# EAGLE design NSL_Cylon (EAGLE 5.10)
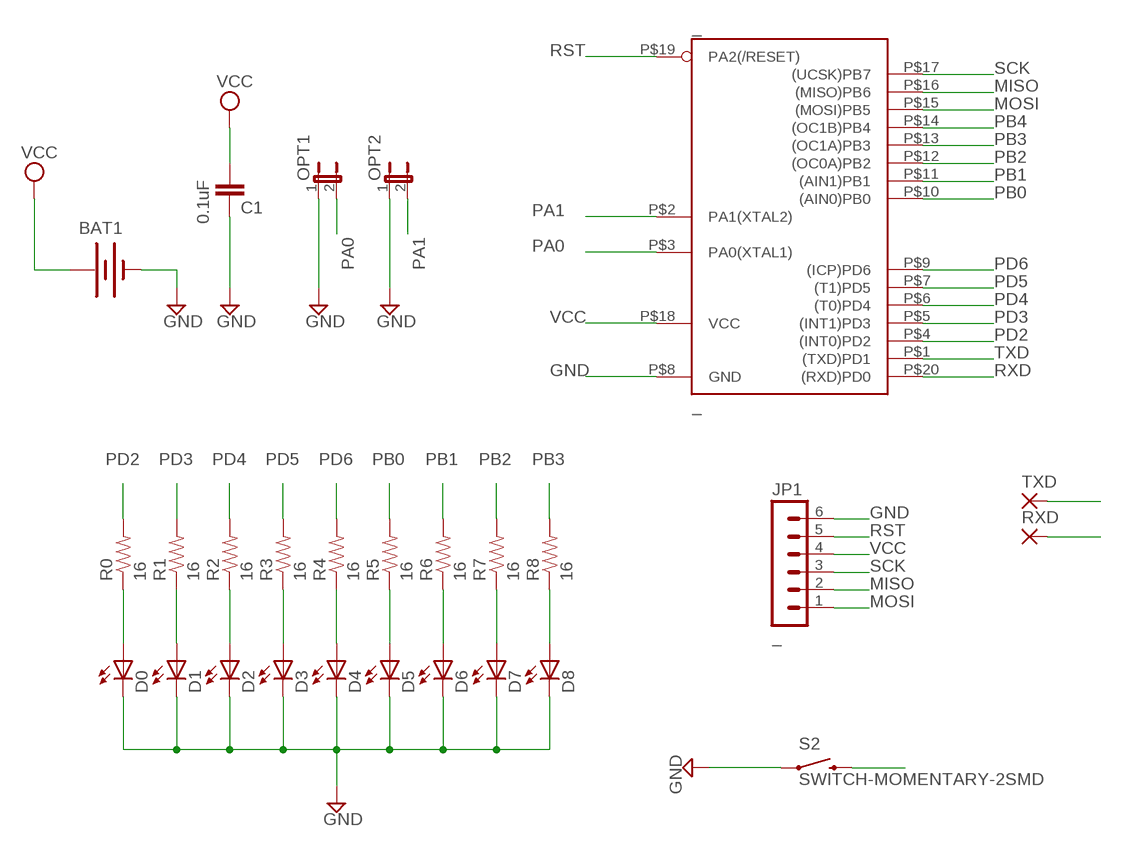
[diagram p0: schematic, sheet 1]

## Parts
_  _  TINY2313-*M*  [MLF20]
BAT1  SPARKFUN_BATTERYSPARKFUN_BATTCOMM_20MM_LINX  [SPARKFUN_BATTCOM_20MM_LINX]
C1  0.1uF  CAP0805  [0805]
D0  SPARKFUN_LED1206  [SPARKFUN_LED-1206]
D1  SPARKFUN_LED1206  [SPARKFUN_LED-1206]
D2  SPARKFUN_LED1206  [SPARKFUN_LED-1206]
D3  SPARKFUN_LED1206  [SPARKFUN_LED-1206]
D4  SPARKFUN_LED1206  [SPARKFUN_LED-1206]
D5  SPARKFUN_LED1206  [SPARKFUN_LED-1206]
D6  SPARKFUN_LED1206  [SPARKFUN_LED-1206]
D7  SPARKFUN_LED1206  [SPARKFUN_LED-1206]
D8  SPARKFUN_LED1206  [SPARKFUN_LED-1206]
JP1  _  MA06-1  [MA06-1]
OPT1  JUMPER-2PTH  [1X02]
OPT2  JUMPER-2PTH  [1X02]
R0  16  RESISTOR0603-RES  [0603-RES]
R1  16  RESISTOR0603-RES  [0603-RES]
R2  16  RESISTOR0603-RES  [0603-RES]
R3  16  RESISTOR0603-RES  [0603-RES]
R4  16  RESISTOR0603-RES  [0603-RES]
R5  16  RESISTOR0603-RES  [0603-RES]
R6  16  RESISTOR0603-RES  [0603-RES]
R7  16  RESISTOR0603-RES  [0603-RES]
R8  16  RESISTOR0603-RES  [0603-RES]
RXD  SMD2  [SMD1,27-2,54]
S2  SWITCH-MOMENTARY-2SMD  [TACTILE_SWITCH_SMD]
TXD  SMD2  [SMD1,27-2,54]

## Nets
GND [power]: _.P$8(GND) BAT1.2(-) C1.2 D0.C D1.C D2.C D3.C D4.C D5.C D6.C D7.C D8.C JP1.6 OPT1.1 OPT2.1 S2.1
MISO: _.P$16((MISO)PB6) JP1.2
MOSI: _.P$15((MOSI)PB5) JP1.1
N$8 [leds]: D0.A R0.1
N$9 [leds]: D1.A R1.1
N$10 [leds]: D2.A R2.1
N$11 [leds]: D3.A R3.1
N$12 [leds]: D4.A R4.1
N$13 [leds]: D5.A R5.1
N$14 [leds]: D6.A R6.1
N$15 [leds]: D7.A R7.1
N$16 [leds]: D8.A R8.1
PA0: _.P$3(PA0(XTAL1)) OPT1.2
PA1: _.P$2(PA1(XTAL2)) OPT2.2
PB0: _.P$10((AIN0)PB0) R5.2
PB1: _.P$11((AIN1)PB1) R6.2
PB2: _.P$12((OC0A)PB2) R7.2
PB3: _.P$13((OC1A)PB3) R8.2
PB4: _.P$14((OC1B)PB4) S2.3
PD2: _.P$4((INT0)PD2) R0.2
PD3: _.P$5((INT1)PD3) R1.2
PD4: _.P$6((T0)PD4) R2.2
PD5: _.P$7((T1)PD5) R3.2
PD6: _.P$9((ICP)PD6) R4.2
RST: _.P$19(PA2(/RESET)) JP1.5
RXD: _.P$20((RXD)PD0) RXD.1(P)
SCK: _.P$17((UCSK)PB7) JP1.3
TXD: _.P$1((TXD)PD1) TXD.1(P)
VCC [power]: _.P$18(VCC) BAT1.1(+) C1.1 JP1.4

## Library data of the parts
_ = NSL_Cylon:TINY2313*: Atmel Tiny2313 2K Flash, 128 bytes EEPROM, 128 bytes RAM
BAT1 = NSL:SPARKFUN_BATTERY: Battery Holders Various common sizes : AA, AAA, 20mm coin cell and 12mm coin cell.
C1 = SparkFun:CAP: Capacitor Standard 0603 ceramic capacitor, and 0.1" leaded capacitor.
D0 D1-D8 = NSL:SPARKFUN_LED: LEDs Standard schematic elements and footprints for 5mm, 3mm, 1206, and 0603 sized LEDs. 5mm - Spark Fun Electronics SKU : COM-00529 (and others)
JP1 = con-lstb:MA06-1: PIN HEADER
OPT1 OPT2 = SparkFun:JUMPER-2: Jumper Basic 0.1" spaced jumper. Use with breakaway headers.
R0 R1-R8 = SparkFun:RESISTOR: Resistor Basic schematic elements and footprints for 0603, 1206, and PTH 1/10th watt (small) resistors.
RXD TXD = wirepad:SMD2: SMD PAD
S2 = SparkFun:SWITCH-MOMENTARY-2

## Net classes
1 power: width 0.254 mm
2 leds: width 0.508 mm

## Board
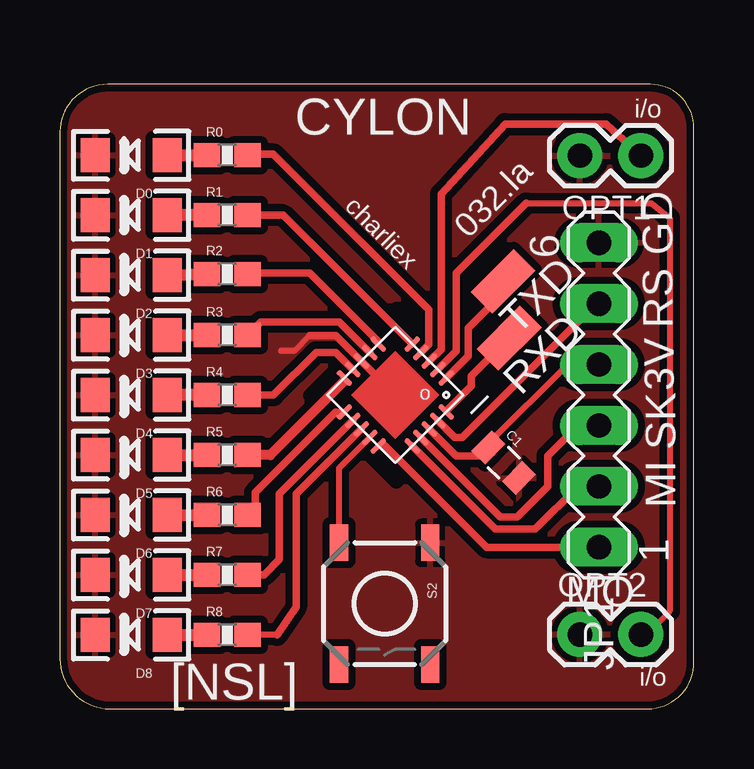
[diagram p1: board, top side]
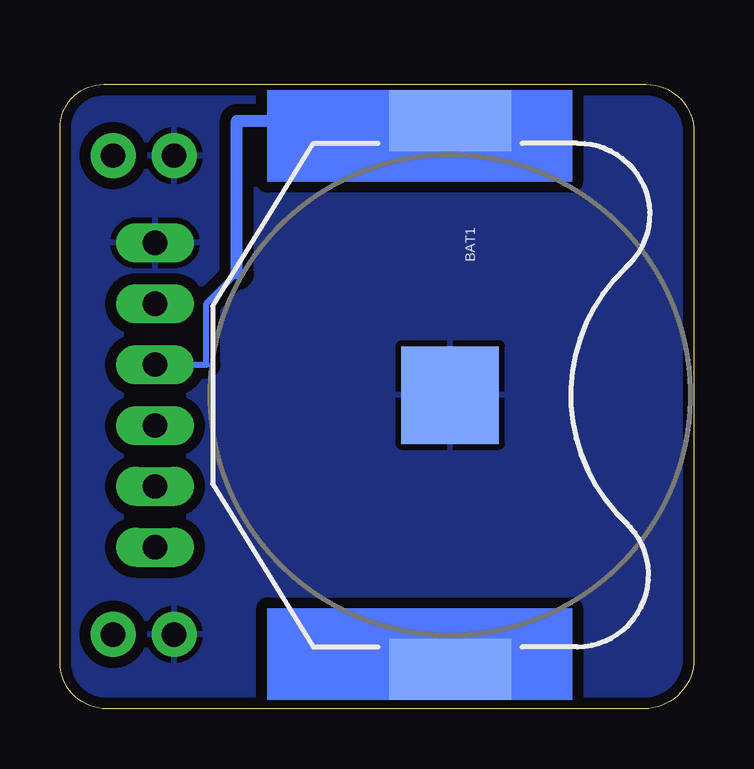
[diagram p2: board, bottom side, seen from below]

Size 26.42 x 26.04 mm. Coordinates in mm from the lower left corner, seen from the top.
Outline: 24.48,0 arc90 26.42,1.94 26.42,24.2 arc90 24.58,26.04 1.98,26.04 arc90 0,24.05 0,2.08 arc90 2.08,0 24.48,0
Copper layers (1*16): Top 0.0356mm / dielectric 1.5011mm / Bottom 0.0356mm
Design rules "SparkFun-mod *": minimum track width 10mil, minimum drill 20mil, track to track 6mil, track to pad 6mil, pad to pad 8mil, via to via 8mil, smd to smd 8mil, copper to edge 12mil, drill to drill 8mil, minimum pad ring 12mil, minimum via ring 10mil, stop-mask expansion 4mil, vias tented up to drill 25mil, thermal gap 10mil
tRestrict: area 10.4,9.5 to 17.6,16.7
Milling: 8 lines

### Footprints (pad centres in the part's own frame; a part is rotated, then mirrored left to right if it is on the bottom)
MLF20 = smd 0.8 x 0.23: P$1 -2,1; P$2 -2,0.5; P$3 -2,0; P$4 -2,-0.5; P$5 -2,-1; P$11 2,-1; P$12 2,-0.5; P$13 2,0; P$14 2,0.5; P$15 2,1 | smd 0.23 x 0.8: P$6 -1,-2; P$7 -0.5,-2; P$8 0,-2; P$9 0.5,-2; P$10 1,-2; P$16 1,2; P$17 0.5,2; P$18 0,2; P$19 -0.5,2; P$20 -1,2
SPARKFUN_BATTCOM_20MM_LINX = smd 2.54 x 5.08: 1 -11.43,0; 3 11.43,0 | smd 4.064 x 4.064: 2 0,0
0805 = smd 0.8 x 1.2: 1 -0.9,0; 2 0.9,0
SPARKFUN_LED-1206 = smd 1.2 x 1.4: A -1.5,0; C 1.5,0
MA06-1 = drill 1.016 long: 1 -6.35,0; 2 -3.81,0; 3 -1.27,0; 4 1.27,0; 5 3.81,0; 6 6.35,0
1X02 = drill 1.016 pad 1.88 round: 1 0,0; 2 2.54,0
0603-RES = smd 1.1 x 1: 1 -0.85,0; 2 0.85,0
SMD1,27-2,54 = smd 1.27 x 2.54: 1 0,0
TACTILE_SWITCH_SMD = smd 1.524 x 0.762: 1 -2.54,1.905; 2 2.54,1.905; 3 -2.54,-1.905; 4 2.54,-1.905

### Placement (x,y rotation side)
_  13.97,13.08 225 top
BAT1  10.16,13.08 270 bottom
C1  18.49,10.26 315 top
D0  2.97,23.08 180 top
D1  2.97,20.58 180 top
D2  2.97,18.08 180 top
D3  2.97,15.58 180 top
D4  2.97,13.08 180 top
D5  2.97,10.58 180 top
D6  2.97,8.08 180 top
D7  2.97,5.58 180 top
D8  2.97,3.08 180 top
JP1  22.45,13.08 90 top
OPT1  21.66,23.06 0 top
OPT2  21.66,3.1 0 top
R0  6.97,23.08 0 top
R1  6.97,20.58 0 top
R2  6.97,18.13 0 top
R3  6.97,15.58 0 top
R4  6.97,13.08 0 top
R5  6.97,10.58 0 top
R6  6.97,8.08 0 top
R7  6.97,5.58 0 top
R8  6.97,3.08 0 top
RXD  18.72,15.45 135 top
S2  13.53,4.38 270 top
TXD  18.46,17.83 135 top

### Tracks (layer width: path | path; a pad name or v marks a point on that pad's centre or on a via)
GND
  Top 0.254: 10.41,15.56 9.78,14.92 9.21,14.92
  Top 0.305: 13.97,13.08 _.P$8 11.49,15.56 10.41,15.56
  pour Top (isolate 0.305): 26.54,-1.27 26.54,27.56 0.06,27.56 arc90 -2.29,22.68 -2.29,2.28 arc90 -1.15,-1.4
  pour Bottom (isolate 0.457): 27.94,-2.16 -2.54,-2.16 -2.54,28.32 27.94,28.32
MISO
  Top 0.254: 21.59,9.27 JP1.2
  Top 0.305: _.P$16 18.14,7.49 19.81,7.49 21.59,9.27
MOSI
  Top 0.254: _.P$15 13.55,10.96
  Top 0.305: 13.55,10.96 17.78,6.73 JP1.1
N$8
  Top 0.508: D0.A R0.1
N$9
  Top 0.508: R1.1 D1.A
N$10
  Top 0.508: D2.A R2.1
N$11
  Top 0.508: D3.A R3.1
N$12
  Top 0.508: R4.1 D4.A
N$13
  Top 0.508: D5.A R5.1
N$14
  Top 0.508: D6.A R6.1
N$15
  Top 0.508: D7.A R7.1
N$16
  Top 0.508: D8.A R8.1
PA0
  Top 0.305: _.P$3 15.88,14.99 15.88,21.46 18.54,24.38 22.75,24.38 OPT1.2
PA1
  Top 0.254: _.P$2 15.79,14.2 | OPT2.2 24.44,3.1 25.4,4.06 25.4,20.45 24.64,21.08 19.43,21.08
  Top 0.305: 15.79,14.2 16.51,14.92 16.51,18.16 19.43,21.08
PB0
  Top 0.254: _.P$10 11.85,13.66
  Top 0.406: 11.85,13.66 8.77,10.58 R5.2
PB1
  Top 0.254: _.P$11 11.49,12.37 | 8.13,8.39 R6.2
  Top 0.305: 11.49,12.37 8.13,9.02 8.13,8.39
PB2
  Top 0.305: _.P$12 9.14,8.96 9.14,6.22 8.5,5.58 R7.2
PB3
  Top 0.254: 9.05,3.08 R8.2
  Top 0.305: _.P$13 9.84,8.95 9.84,4.25 9.05,3.08
PB4
  Top 0.254: S2.3 11.62,10.02 _.P$14
PD2
  Top 0.254: 7.85,23.11 R0.2
  Top 0.305: _.P$4 15.37,15.18 15.37,16.64 8.89,23.11 7.85,23.11
PD3
  Top 0.305: R1.2 9.3,20.58 _.P$5
PD4
  Top 0.254: _.P$6 13.26,15.31 | 7.85,18.16 R2.2
  Top 0.305: 13.26,15.31 10.41,18.16 7.85,18.16
PD5
  Top 0.305: _.P$7 11.63,16.13 8.37,16.13 R3.2
PD6
  Top 0.305: _.P$9 11.49,14.86 10.67,14.86 8.89,13.08 R4.2
RST
  Top 0.254: 22.35,16.89 JP1.5
  Top 0.305: _.P$19 16.46,11.3 16.76,11.3 22.35,16.89
RXD
  Top 0.254: RXD.1 19.05,15.33 | _.P$20 16.09,12.41
  Top 0.305: RXD.1 17.14,13.88 17.14,13.46 16.09,12.41
SCK
  Top 0.305: _.P$17 18.34,8 19.05,8 20.32,9.27 20.32,10.54 21.59,11.81 JP1.3
TXD
  Top 0.254: 19.05,17.91 TXD.1
  Top 0.305: _.P$1 17.02,14.71 17.02,15.88 19.05,17.91
VCC
  Top 0.254: 17.5,10.54 C1.1 17.85,11.05 21.15,14.35 JP1.4
  Top 0.305: _.P$18 16.51,10.54 17.5,10.54
  Bottom 0.254: 19.05,18.16 20.32,16.89 20.32,14.35 JP1.4
  Bottom 0.508: BAT1.1 13.46,24.51 19.05,24.51 19.05,18.16
  Bottom 2.54: 13.46,24.51 6.86,24.51
(copper drawn outside any net)
  shapes: Bottom area x2

### Text on the board
_tsilk: i/o | CYLON | charliex | 032.la | GD | RS | o | 3V | SK | MI | MO | i/o | [NSL]